# Altium schematic sheet DSP.SchDoc
size A4
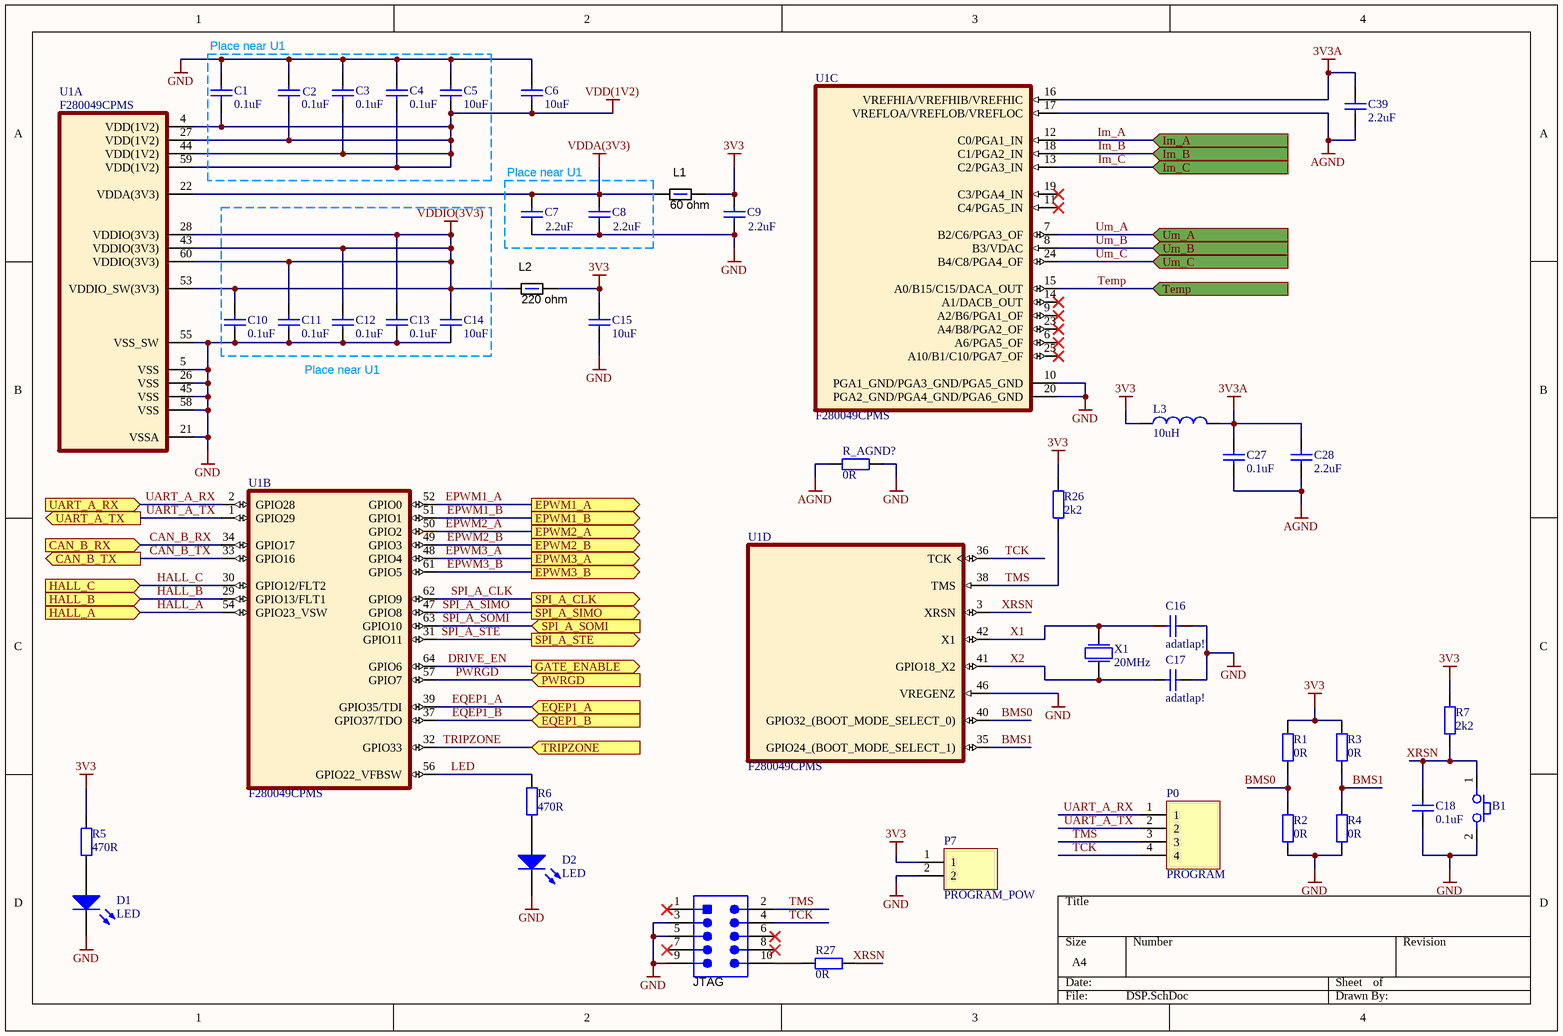
[diagram p0: DSP.SchDoc]

## Parts
B1  Button  [FP_BTN_SMD_3x6]  (value not drawn)
C1  0.1uF  [FP_0603_CAP_080]
C2  0.1uF  [FP_0603_CAP_080]
C3  0.1uF  [FP_0603_CAP_080]
C4  0.1uF  [FP_0603_CAP_080]
C5  10uF  [FP_0603_CAP_080]
C6  10uF  [FP_0603_CAP_080]
C7  2.2uF  [FP_0603_CAP_080]
C8  2.2uF  [FP_0603_CAP_080]
C9  2.2uF  [FP_0603_CAP_080]
C10  0.1uF  [FP_0603_CAP_080]
C11  0.1uF  [FP_0603_CAP_080]
C12  0.1uF  [FP_0603_CAP_080]
C13  0.1uF  [FP_0603_CAP_080]
C14  10uF  [FP_0603_CAP_080]
C15  10uF  [FP_0603_CAP_080]
C16  adatlap!  [FP_0603_CAP_080]
C17  adatlap!  [FP_0603_CAP_080]
C18  0.1uF  [FP_0603_CAP_080]
C27  0.1uF  [FP_0603_CAP_080]
C28  2.2uF  [FP_0603_CAP_080]
C39  2.2uF  [FP_0603_CAP_080]
D1  LED  [FP_0805_LED_GREEN]
D2  LED  [FP_0805_LED_GREEN]
JTAG  FTSH-105-01-F-DV-K  [Samtec_FTSH-105-01-x-DV-K]  (value not drawn)
L1  ValueDisplayed: 60 ohm  [FP_0805_RES]  (hidden comment: BKP2125HS600-T)
L2  ValueDisplayed: 220 ohm  [FP_0805_RES]  (hidden comment: BLM21PG221SN1D)
L3  10uH  [FP_0805_IND]
P0  PROGRAM  [FP_CONN4_TAP_254MM]
P7  PROGRAM_POW  [FP_CONN2_TAP_254MM]
R1  0R  [FP_0603_RES]
R2  0R  [FP_0603_RES]
R3  0R  [FP_0603_RES]
R4  0R  [FP_0603_RES]
R5  470R  [FP_0603_RES]
R6  470R  [FP_0603_RES]
R7  2k2  [FP_0603_RES]
R26  2k2  [FP_0603_RES]
R27  0R  [FP_0603_RES]
R_AGND?  0R  [FP_0805_RES]
U1  F280049CPMS  [PM0064A_M]  (parts A,B,C,D of 4)
X1  20MHz  [FP_CRYSTAL_HC49]

## Ports
CAN_B_RX (in), CAN_B_TX (out), EPWM1_A (out), EPWM1_B (out), EPWM2_A (out), EPWM2_B (out), EPWM3_A (out), EPWM3_B (out), EQEP1_A (in), EQEP1_B (in), GATE_ENABLE (out), HALL_A (in), HALL_B (in), HALL_C (in), Im_A (in), Im_B (in), Im_C (in), PWRGD (in), SPI_A_CLK (out), SPI_A_SIMO (out), SPI_A_SOMI (in), SPI_A_STE (out), Temp (in), TRIPZONE (in), UART_A_RX (in), UART_A_TX (out), Um_A (in), Um_B (in), Um_C (in)

## Nets
3V3: C9.1 C15.1 L1.2 L2.2 L3.1 P7.1 R1.2 R3.2 R5.2 R7.2 R26.2
3V3A: C27.1 C28.1 C39.1 L3.2 U1.16(VREFHIA/VREFHIB/VREFHIC)
AGND: C27.2 C28.2 C39.2 R_AGND?.1 U1.17(VREFLOA/VREFLOB/VREFLOC)
GND: B1.2 C1.1 C2.1 C3.1 C4.1 C5.1 C6.1 C7.2 C8.2 C9.2 C10.2 C11.2 C12.2 C13.2 C14.2 C15.2 C16.1 C17.1 C18.1 D1.2(K) D2.2(K) JTAG.3 JTAG.5 JTAG.9 P7.2 R2.1 R4.1 R_AGND?.2 U1.5(VSS) U1.10(PGA1_GND/PGA3_GND/PGA5_GND) U1.20(PGA2_GND/PGA4_GND/PGA6_GND) U1.21(VSSA) U1.26(VSS) U1.45(VSS) U1.46(VREGENZ) U1.55(VSS_SW) U1.58(VSS)
VDD(1V2): C1.2 C2.2 C3.2 C4.2 C5.2 C6.2 U1.4(VDD(1V2)) U1.27(VDD(1V2)) U1.44(VDD(1V2)) U1.59(VDD(1V2))
VDDA(3V3): C7.1 C8.1 L1.1 U1.22(VDDA(3V3))
VDDIO(3V3): C10.1 C11.1 C12.1 C13.1 C14.1 L2.1 U1.28(VDDIO(3V3)) U1.43(VDDIO(3V3)) U1.53(VDDIO_SW(3V3)) U1.60(VDDIO(3V3))
BMS0: R1.1 R2.2 U1.40(GPIO32_(BOOT_MODE_SELECT_0))
BMS1: R3.1 R4.2 U1.35(GPIO24_(BOOT_MODE_SELECT_1))
CAN_B_RX: U1.34(GPIO17) ; port CAN_B_RX
CAN_B_TX: U1.33(GPIO16) ; port CAN_B_TX
DRIVE_EN: U1.64(GPIO6) ; port GATE_ENABLE
EPWM1_A: U1.52(GPIO0) ; port EPWM1_A
EPWM1_B: U1.51(GPIO1) ; port EPWM1_B
EPWM2_A: U1.50(GPIO2) ; port EPWM2_A
EPWM2_B: U1.49(GPIO3) ; port EPWM2_B
EPWM3_A: U1.48(GPIO4) ; port EPWM3_A
EPWM3_B: U1.61(GPIO5) ; port EPWM3_B
EQEP1_A: U1.39(GPIO35/TDI) ; port EQEP1_A
EQEP1_B: U1.37(GPIO37/TDO) ; port EQEP1_B
HALL_A: U1.54(GPIO23_VSW) ; port HALL_A
HALL_B: U1.29(GPIO13/FLT1) ; port HALL_B
HALL_C: U1.30(GPIO12/FLT2) ; port HALL_C
Im_A: U1.12(C0/PGA1_IN) ; port Im_A
Im_B: U1.18(C1/PGA2_IN) ; port Im_B
Im_C: U1.13(C2/PGA3_IN) ; port Im_C
LED: R6.2 U1.56(GPIO22_VFBSW)
PWRGD: U1.57(GPIO7) ; port PWRGD
SPI_A_CLK: U1.62(GPIO9) ; port SPI_A_CLK
SPI_A_SIMO: U1.47(GPIO8) ; port SPI_A_SIMO
SPI_A_SOMI: U1.63(GPIO10) ; port SPI_A_SOMI
SPI_A_STE: U1.31(GPIO11) ; port SPI_A_STE
TCK: JTAG.4 P0.4 U1.36(TCK)
Temp: U1.15(A0/B15/C15/DACA_OUT) ; port Temp
TMS: JTAG.2 P0.3 R26.1 U1.38(TMS)
TRIPZONE: U1.32(GPIO33) ; port TRIPZONE
UART_A_RX: P0.1 U1.2(GPIO28) ; port UART_A_RX
UART_A_TX: P0.2 U1.1(GPIO29) ; port UART_A_TX
Um_A: U1.7(B2/C6/PGA3_OF) ; port Um_A
Um_B: U1.8(B3/VDAC) ; port Um_B
Um_C: U1.24(B4/C8/PGA4_OF) ; port Um_C
X1: C16.2 U1.42(X1) X1.2
X2: C17.2 U1.41(GPIO18_X2) X1.1
XRSN: B1.1 C18.2 R7.1 R27.1 U1.3(XRSN)
NetD1_1: D1.1(A) R5.1
NetD2_1: D2.1(A) R6.1
NetJTAG_10: JTAG.10 R27.2

Not connected (* = marked no-connect by the designer): JTAG 1* 6* 7* 8*; U1 6(A6/PGA5_OF)* 9(A2/B6/PGA1_OF)* 11(C4/PGA5_IN)* 14(A1/DACB_OUT)* 19(C3/PGA4_IN)* 23(A4/B8/PGA2_OF)* 25(A10/B1/C10/PGA7_OF)*

## Notes on the sheet
- Place near U1

## Library data of the parts
B1 = Button 2P: Push button
C1-C18 C27 C28 C39 = CAP: Capacitor
  C1-C4 C10-C13 C18 C27: Value: 0.1uF
  C5 C6 C14 C15: Value: 10uF
  C7-C9 C28 C39: Value: 2.2uF
  C16 C17: Value: adatlap!
D1 D2 = LED: Typical RED GaAs LED; pin to pad: 1>A 2>K
JTAG = CMP-0075670-1: Header (Shrouded), 1.27mm, 5x2, Gold, SMT; Manufacturer: Samtec; Pitch_mm: 1.27; Gender: Male; Shrouded: Y; Row_Count: 2; Current_A: 3.3A; CNHeader: False; PartNumber: FTSH-105-01-F-DV-K; PackageReference: Header(Shrouded), 1.27mm, 5x2, SMT; CompType: Header; RoHS: Y; MountType: SMT; ComponentLink1Description: Datasheet URL; ComponentLink1URL: http://suddendocs.samtec.com/prints/ftsh-1xx-xx-xxx-dv-xxx-mkt.pdf; Orientation: Vertical; PinCount: 10; RowSpacing_mm: 1.27; ContactFinish: Gold; Color: Black; Cert_CSA: Y; Cert_UL: Y; Publisher: Texas Instruments; LatestRevisionDate: 2017-07-12; Supplier 1: Digi-Key; Supplier Part Number 1: SAM8796-ND; Supplier 2: Newark; Supplier Part Number 2: 45P5160; CT: False
L1 = CMP-0003306-1: Ferrite Bead, 60 ohm @ 100 MHz, 3 A, 0805; Manufacturer: Taiyo Yuden; Value: 60 ohm; Imax_A: 3A; DCR_ohm: 0.025; Value1: 0.025 ohm; SizeAreaWB_mm2: 6.75; SizeArea_mm2: 2.5; SizeX_mm: 2; SizeY_mm: 1.25; SizeZ_mm: 1.45; ZTyp@100MHz_Ohm: 60; PartNumber: BKP2125HS600-T; CompType: Ferrite Bead; Value2: 3A; MountType: SMT; PackageReference: 0805; Published: 2014-04-30; Publisher: Texas Instruments; LatestRevisionDate: 2017-03-09; ComponentLink1Description: Datasheet link; ComponentLink1URL: http://www.yuden.co.jp/productdata/catalog/en/mlci08_e.pdf; RoHS: Y; Supplier 1: Digi-Key; Supplier Part Number 1: 587-1932-1-ND; Supplier 2: Newark; Supplier Part Number 2: 30K5394 LF BKP2125HS600-T; Supplier 3: Mouser; Supplier Part Number 3: 963-BKP2125HS600-T
L2 = CMP-0003363-1: Ferrite Bead, 220 ohm @ 100 MHz, 2 A, 0805; Manufacturer: MuRata; Value: 220 ohm; Imax_A: 2A; DCR_ohm: 0.045; Value1: 0.045 ohm; SizeAreaWB_mm2: 6.75; SizeArea_mm2: 2.5; SizeX_mm: 2; SizeY_mm: 1.25; SizeZ_mm: 1.45; ZTyp@100MHz_Ohm: 220; PartNumber: BLM21PG221SN1D; CompType: Ferrite Bead; Value2: 2A; MountType: SMT; PackageReference: 0805; Published: 2014-04-30; Publisher: Texas Instruments; LatestRevisionDate: 2017-03-09; ComponentLink1Description: Datasheet link; ComponentLink1URL: http://search.murata.co.jp/Ceramy/image/img/PDF/ENG/L0110S0100BLM21P.pdf; RoHS: Y; Supplier 1: Digi-Key; Supplier Part Number 1: 490-1054-1-ND; Supplier 2: Newark; Supplier Part Number 2: 73M9167; Supplier 3: Mouser; Supplier Part Number 3: 81-BLM21P221SG
L3 = Inductivity: Part Class: Inductivity
P0 = Connector_4pin: 4pin Connector
P7 = Connector_2pin: 2pin connector
R1-R7 R26 R27 R_AGND? = RES: Resistor
  R1-R4 R27 R_AGND?: Value: 0R
  R5 R6: Value: 470R
  R7 R26: Value: 2k2
U1 = F280049CPMS: Piccolo™ Microcontroller With InstaSPIN-FOC and CLB 64-LQFP -40 to 125 /; MF: Texas Instruments; Digi-Key_Part_Number: 296-49637-ND; Package: LQFP-64 Texas Instruments; Digi-Key_Purchase_URL: https://www.digikey.hu/product-detail/en/texas-instruments/F280049CPMS/296-49637-ND/8322725?utm_source=snapeda&utm_medium=aggregator&utm_campaign=symbol; SnapEDA_Link: https://www.snapeda.com/parts/F280049CPMS/Texas%20Instruments/view-part/?ref=snap; MP: F280049CPMS; Value: *
X1 = Crystal: Quarz Crystal; Value: 8MHz